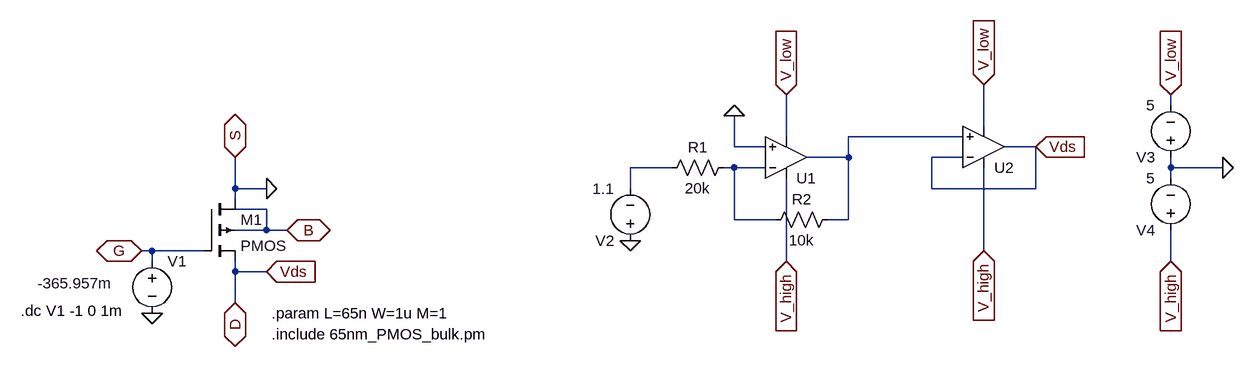
[diagram p0: schematic pmos_trial.asc]
pmos_trial.asc, the LTspice schematic file:
Version 4
SHEET 1 1844 680
WIRE 1744 -112 1744 -128
WIRE 1456 -80 1456 -144
WIRE 1152 -64 1152 -128
WIRE 1424 -64 1248 -64
WIRE 1072 -48 1072 -96
WIRE 1120 -48 1072 -48
WIRE 1536 -48 1488 -48
WIRE 1248 -32 1248 -64
WIRE 1248 -32 1184 -32
WIRE 1424 -32 1376 -32
WIRE 976 -16 912 -16
WIRE 1072 -16 1056 -16
WIRE 1120 -16 1072 -16
WIRE 1744 -16 1744 -32
WIRE 1824 -16 1744 -16
WIRE 1744 0 1744 -16
WIRE 304 16 304 -32
WIRE 352 16 304 16
WIRE 912 16 912 -16
WIRE 1376 16 1376 -32
WIRE 1536 16 1536 -48
WIRE 1536 16 1376 16
WIRE 304 32 304 16
WIRE 352 48 304 48
WIRE 1072 64 1072 -16
WIRE 1136 64 1072 64
WIRE 1248 64 1248 -32
WIRE 1248 64 1216 64
WIRE 352 80 352 48
WIRE 352 80 304 80
WIRE 384 80 352 80
WIRE 176 112 160 112
WIRE 256 112 176 112
WIRE 1456 112 1456 -16
WIRE 176 128 176 112
WIRE 1152 128 1152 0
WIRE 1744 128 1744 80
WIRE 304 144 304 128
WIRE 352 144 304 144
WIRE 304 192 304 144
FLAG 160 112 G
IOPIN 160 112 BiDir
FLAG 304 192 D
IOPIN 304 192 BiDir
FLAG 304 -32 S
IOPIN 304 -32 BiDir
FLAG 384 80 B
IOPIN 384 80 BiDir
FLAG 176 208 0
FLAG 352 16 0
FLAG 352 144 Vds
IOPIN 352 144 In
FLAG 1072 -96 0
FLAG 912 96 0
FLAG 1824 -16 0
FLAG 1744 -128 V_low
IOPIN 1744 -128 In
FLAG 1744 128 V_high
IOPIN 1744 128 In
FLAG 1152 -128 V_low
IOPIN 1152 -128 In
FLAG 1456 -144 V_low
IOPIN 1456 -144 In
FLAG 1456 112 V_high
IOPIN 1456 112 In
FLAG 1152 128 V_high
IOPIN 1152 128 In
FLAG 1536 -48 Vds
IOPIN 1536 -48 In
SYMBOL pmos4 256 32 R0
SYMATTR InstName M1
SYMATTR Value2 l={L} w={W} ad='2*65n*{W}' as='2*65n*{W}' pd='2*(2*65n+{W})' ps='2*(2*65n+{W})' m={M}
SYMBOL voltage 176 112 R0
WINDOW 3 -176 50 Left 2
WINDOW 123 0 0 Left 0
WINDOW 39 0 0 Left 0
SYMATTR InstName V1
SYMATTR Value -365.957m
SYMBOL voltage 912 112 R180
WINDOW 123 0 0 Left 0
WINDOW 39 0 0 Left 0
SYMATTR InstName V2
SYMATTR Value 1.1
SYMBOL res 1072 -32 R90
WINDOW 0 0 56 VBottom 2
WINDOW 3 32 56 VTop 2
SYMATTR InstName R1
SYMATTR Value 20k
SYMBOL res 1232 48 R90
WINDOW 0 0 56 VBottom 2
WINDOW 3 32 56 VTop 2
SYMATTR InstName R2
SYMATTR Value 10k
SYMBOL voltage 1744 -16 R180
WINDOW 123 0 0 Left 0
WINDOW 39 0 0 Left 0
SYMATTR InstName V3
SYMATTR Value 5
SYMBOL voltage 1744 96 R180
WINDOW 123 0 0 Left 0
WINDOW 39 0 0 Left 0
SYMATTR InstName V4
SYMATTR Value 5
SYMBOL Opamps\\UniversalOpamp2 1152 -32 M180
SYMATTR InstName U1
SYMBOL Opamps\\UniversalOpamp2 1456 -48 M180
SYMATTR InstName U2
TEXT 360 208 Left 2 !.param L=65n W=1u M=1
TEXT 360 240 Left 2 !.include 65nm_PMOS_bulk.pm
TEXT -26 204 Left 2 !.dc V1 -1 0 1m

The netlist it stands for:
* pmos_trial.asc
M1 0 G Vds B PMOS l={L} w={W} ad='2*65n*{W}' as='2*65n*{W}' pd='2*(2*65n+{W})' ps='2*(2*65n+{W})' m={M}
V1 G 0 -365.957m
V2 0 N002 1.1
R1 N003 N002 20k
R2 N001 N003 10k
V3 0 V_low 5
V4 V_high 0 5
XU1 0 N003 V_high V_low N001 level.2 Avol=1Meg GBW=10Meg Slew=10Meg ilimit=25m rail=0 Vos=0 phimargin=45 en=0 enk=0 in=0 ink=0 Rin=500Meg  ; pins IN+ IN- V+ V- OUT
XU2 N001 Vds V_high V_low Vds level.2 Avol=1Meg GBW=10Meg Slew=10Meg ilimit=25m rail=0 Vos=0 phimargin=45 en=0 enk=0 in=0 ink=0 Rin=500Meg  ; pins IN+ IN- V+ V- OUT
.model NMOS NMOS
.model PMOS PMOS
.lib standard.mos
.param L=65n W=1u M=1
.include 65nm_PMOS_bulk.pm
.dc V1 -1 0 1m
.lib UniversalOpamps2.sub
.backanno
.end